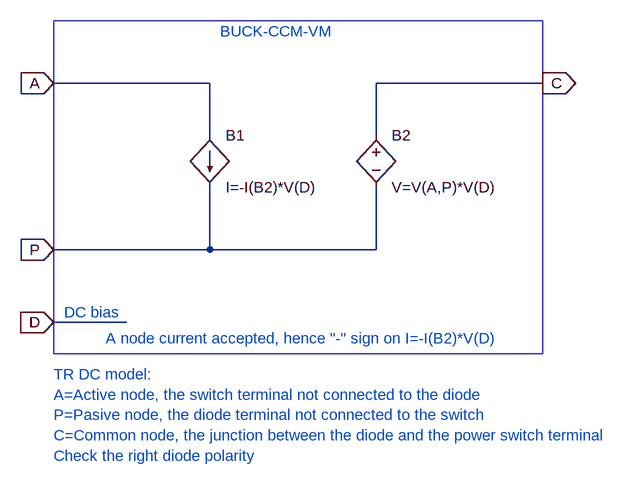
[diagram p0: schematic BUCK-CCM-VM.asc]
BUCK-CCM-VM.asc, the LTspice schematic file:
Version 4
SHEET 1 928 680
WIRE 192 -112 -48 -112
WIRE 704 -112 448 -112
WIRE 192 -32 192 -112
WIRE 448 -32 448 -112
WIRE 192 144 192 48
WIRE 192 144 -48 144
WIRE 448 144 448 48
WIRE 448 144 192 144
WIRE 64 256 -48 256
FLAG -48 -112 A
IOPIN -48 -112 In
FLAG -48 144 P
IOPIN -48 144 In
FLAG 704 -112 C
IOPIN 704 -112 Out
FLAG -48 256 D
IOPIN -48 256 In
SYMBOL bi 192 -32 R0
SYMATTR InstName B1
SYMATTR Value I=-I(B2)*V(D)
SYMBOL bv 448 -48 R0
SYMATTR InstName B2
SYMATTR Value V=V(A,P)*V(D)
TEXT 208 -192 Left 0 ;BUCK-CCM-VM
TEXT -48 336 Left 0 ;TR DC model:\nA=Active node, the switch terminal not connected to the diode\nP=Pasive node, the diode terminal not connected to the switch\nC=Common node, the junction between the diode and the power switch terminal\nCheck the right diode polarity
TEXT 32 280 Left 0 ;A node current accepted, hence "-" sign on I=-I(B2)*V(D)
TEXT -32 240 Left 0 ;DC bias
RECTANGLE Normal 704 304 -48 -208

The netlist it stands for:
* BUCK-CCM-VM.asc
B1 A P I=-I(B2)*V(D)
B2 C P V=V(A,P)*V(D)
* BUCK-CCM-VM
* TR DC model:
* A=Active node, the switch terminal not connected to the diode
* P=Pasive node, the diode terminal not connected to the switch
* C=Common node, the junction between the diode and the power switch terminal
* Check the right diode polarity
* A node current accepted, hence "-" sign on I=-I(B2)*V(D)
* DC bias
.backanno
.end